# Altium schematic sheet core.SchDoc
size A4
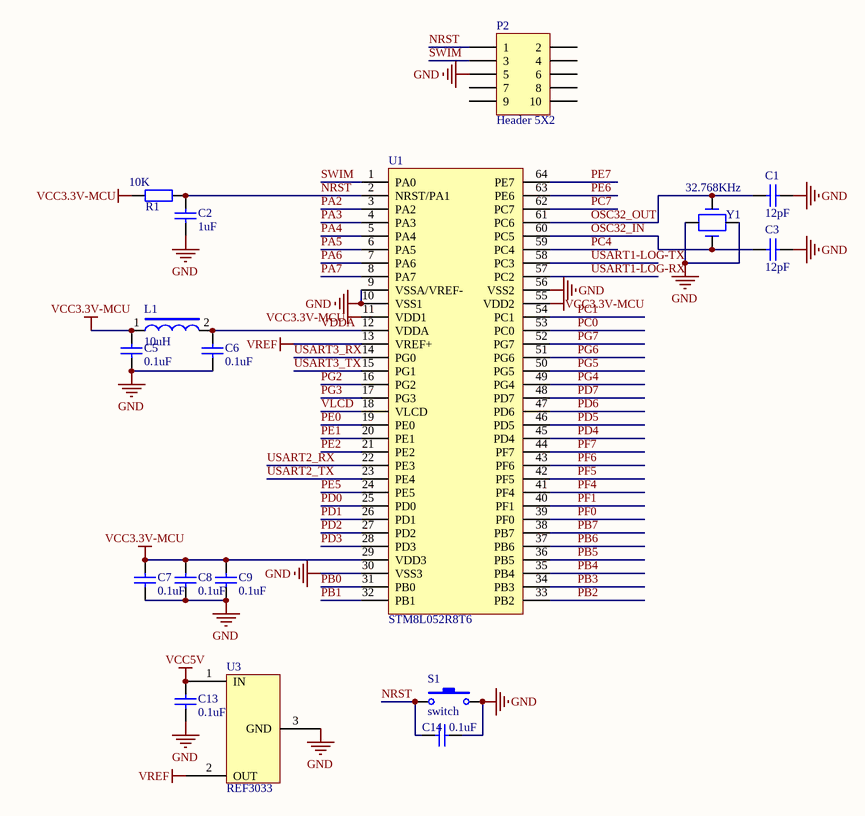
[diagram p0: core.SchDoc]

## Parts
C1  12pF  [0603_C]
C2  1uF  [0603_C]
C3  12pF  [0603_C]
C5  0.1uF  [0603_C]
C6  0.1uF  [0603_C]
C7  0.1uF  [0603_C]
C8  0.1uF  [0603_C]
C9  0.1uF  [0603_C]
C13  0.1uF  [0603_C]
C14  0.1uF  [0603_C]
L1  10uH  [0603_L]
P2  Header 5X2  [2.54-2*5P简牛]
R1  10K  [0603_R]
S1  switch  [SW-SMD_4P-L6.2-W6.2-P4.50-LS9.0]
U1  STM8L052R8T6  [LQFP-64_10X10X05P]
U3  REF3033  [SOT-23(SOT-23-3)]
Y1  32.768KHz  [CRY_MC146]

## Nets
GND: C1.1 C2.1 C3.1 C5.1 C6.1 C7.1 C8.1 C9.1 C13.1 C14.2 P2.5 S1.2 U1.9(VSSA/VREF-) U1.10(VSS1) U1.30(VSS3) U1.56(VSS2) U3.3(GND) Y1.3 Y1.4
VCC3.3V-MCU: C5.2 C7.2 C8.2 C9.2 L1.1 R1.1 U1.11(VDD1) U1.29(VDD3) U1.55(VDD2)
VCC5V: C13.2 U3.1(IN)
VREF: U1.13(VREF+) U3.2(OUT)
NRST: C2.2 C14.1 P2.1 R1.2 S1.1 U1.2(NRST/PA1)
OSC32_IN: C3.2 U1.60(PC5) Y1.1
OSC32_OUT: C1.2 U1.61(PC6) Y1.2
PA2: U1.3(PA2)
PA3: U1.4(PA3)
PA4: U1.5(PA4)
PA5: U1.6(PA5)
PA6: U1.7(PA6)
PA7: U1.8(PA7)
PB0: U1.31(PB0)
PB1: U1.32(PB1)
PB2: U1.33(PB2)
PB3: U1.34(PB3)
PB4: U1.35(PB4)
PB5: U1.36(PB5)
PB6: U1.37(PB6)
PB7: U1.38(PB7)
PC0: U1.53(PC0)
PC1: U1.54(PC1)
PC4: U1.59(PC4)
PC7: U1.62(PC7)
PD0: U1.25(PD0)
PD1: U1.26(PD1)
PD2: U1.27(PD2)
PD3: U1.28(PD3)
PD4: U1.45(PD4)
PD5: U1.46(PD5)
PD6: U1.47(PD6)
PD7: U1.48(PD7)
PE0: U1.19(PE0)
PE1: U1.20(PE1)
PE2: U1.21(PE2)
PE5: U1.24(PE5)
PE6: U1.63(PE6)
PE7: U1.64(PE7)
PF0: U1.39(PF0)
PF1: U1.40(PF1)
PF4: U1.41(PF4)
PF5: U1.42(PF5)
PF6: U1.43(PF6)
PF7: U1.44(PF7)
PG2: U1.16(PG2)
PG3: U1.17(PG3)
PG4: U1.49(PG4)
PG5: U1.50(PG5)
PG6: U1.51(PG6)
PG7: U1.52(PG7)
SWIM: P2.3 U1.1(PA0)
USART1-LOG-RX: U1.57(PC2)
USART1-LOG-TX: U1.58(PC3)
USART2_RX: U1.22(PE3)
USART2_TX: U1.23(PE4)
USART3_RX: U1.14(PG0)
USART3_TX: U1.15(PG1)
VDDA: C6.2 L1.2 U1.12(VDDA)
VLCD: U1.18(VLCD)

Not connected (* = marked no-connect by the designer): P2 2 4 6 7 8 9 10

## Library data of the parts
C1-C3 C5-C9 C13 C14 = Cap: 贴片电容，0603
L1 = L: MLZ1608E100MT000，贴片电感，0603
P2 = Header 5X2: 2.54mm 2*5P 直 简牛
R1 = Res2: 贴片电阻，0603
S1 = switch: 贴片按键，6*6*5
U1 = STM8L052R8T6: STM8L052R8T6,LQFP-64_10x10x05P
U3 = REF3033AIDBZR: 3.0V标准电压输出，SOT-23; autor: caibin
Y1 = CRYSTAL_1: OSC,32.768KHz,+/-25ppm,3.3V,15pF,MC146,-20℃~70℃